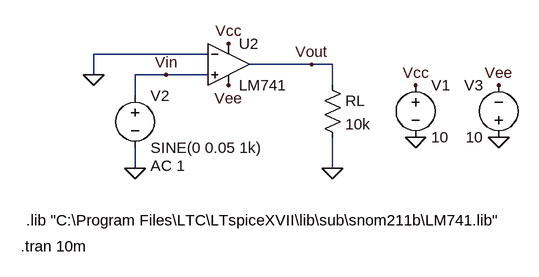
[diagram p0: schematic LM741-comparator.asc]
LM741-comparator.asc, the LTspice schematic file:
Version 4
SHEET 1 880 680
WIRE 176 176 0 176
WIRE 336 192 240 192
WIRE 368 192 336 192
WIRE 0 208 0 176
WIRE 112 208 64 208
WIRE 176 208 112 208
WIRE 368 224 368 192
WIRE 64 240 64 208
WIRE 64 352 64 320
WIRE 368 352 368 304
FLAG 64 352 0
FLAG 496 304 0
FLAG 624 304 0
FLAG 368 352 0
FLAG 496 224 Vcc
FLAG 624 224 Vee
FLAG 208 160 Vcc
FLAG 208 224 Vee
FLAG 0 208 0
FLAG 336 192 Vout
FLAG 112 208 Vin
SYMBOL voltage 496 208 R0
WINDOW 123 0 0 Left 0
WINDOW 39 0 0 Left 0
SYMATTR InstName V1
SYMATTR Value 10
SYMBOL voltage 64 224 R0
WINDOW 123 24 124 Left 2
WINDOW 39 0 0 Left 0
SYMATTR Value2 AC 1
SYMATTR InstName V2
SYMATTR Value SINE(0 0.05 1k)
SYMBOL voltage 624 320 R180
WINDOW 0 24 96 Left 2
WINDOW 3 24 16 Left 2
WINDOW 123 0 0 Left 0
WINDOW 39 0 0 Left 0
SYMATTR InstName V3
SYMATTR Value 10
SYMBOL res 352 208 R0
SYMATTR InstName RL
SYMATTR Value 10k
SYMBOL OpAmps\\opamp2 208 128 R0
SYMATTR InstName U2
SYMATTR Value LM741
TEXT -112 472 Left 2 !.tran 10m
TEXT -104 432 Left 2 !.lib "C:\\Program Files\\LTC\\LTspiceXVII\\lib\\sub\\snom211b\\LM741.lib"

The netlist it stands for:
* LM741-comparator.asc
V1 Vcc 0 10
V2 Vin 0 SINE(0 0.05 1k) AC 1
V3 0 Vee 10
RL Vout 0 10k
XU2 Vin 0 Vcc Vee Vout LM741  ; pins In+ In- V+ V- OUT
.tran 10m
.lib "C:\Program Files\LTC\LTspiceXVII\lib\sub\snom211b\LM741.lib"
.backanno
.end